# EAGLE design jkw_hdmi_v2 (EAGLE 7.6.0)
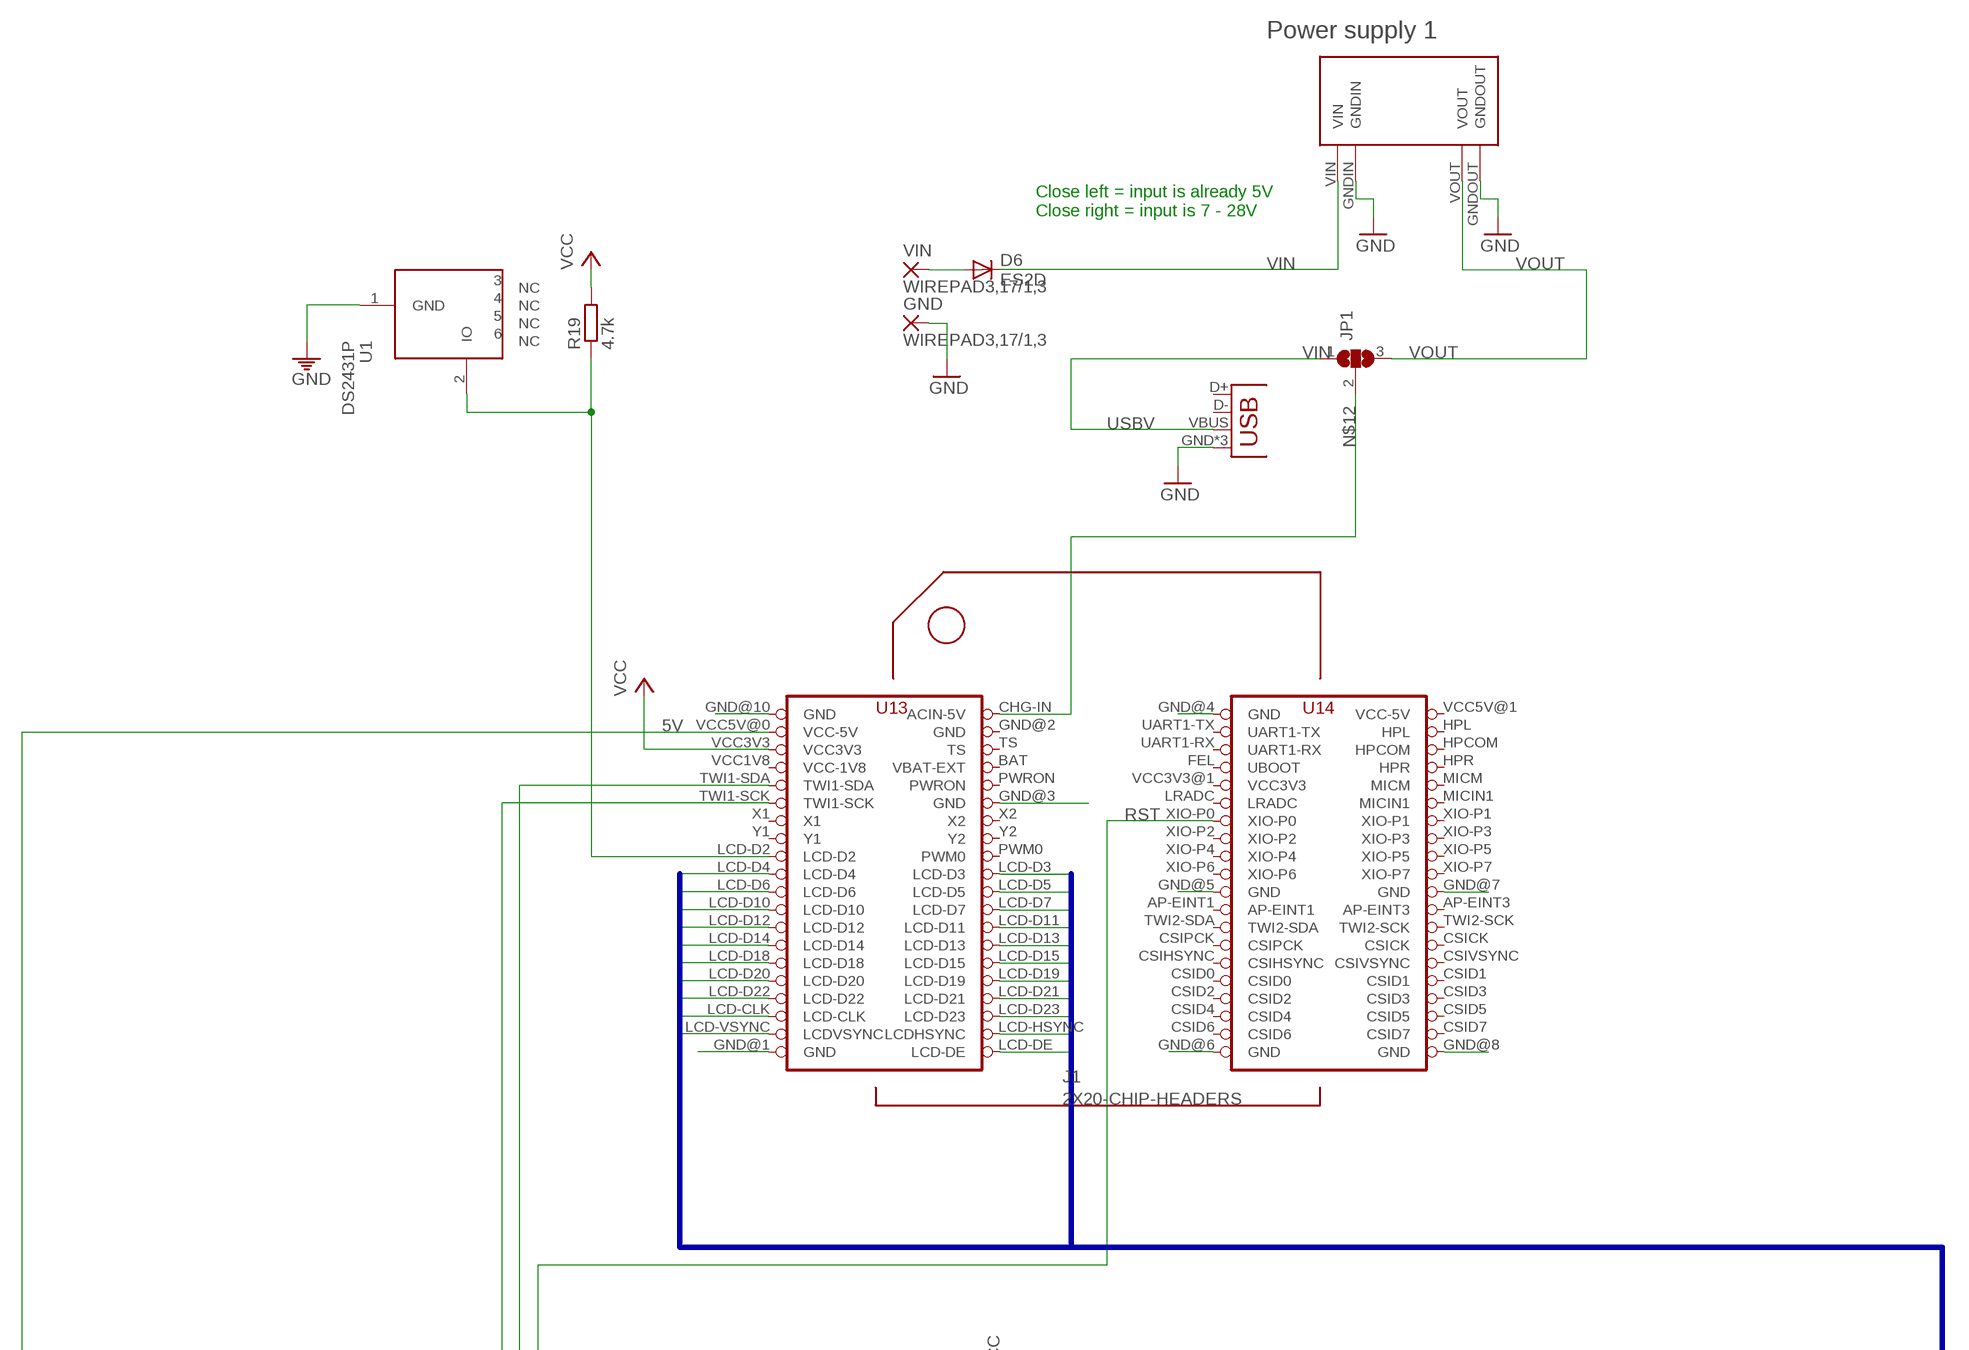
[diagram p0: schematic, sheet 1, part 1 of 2]
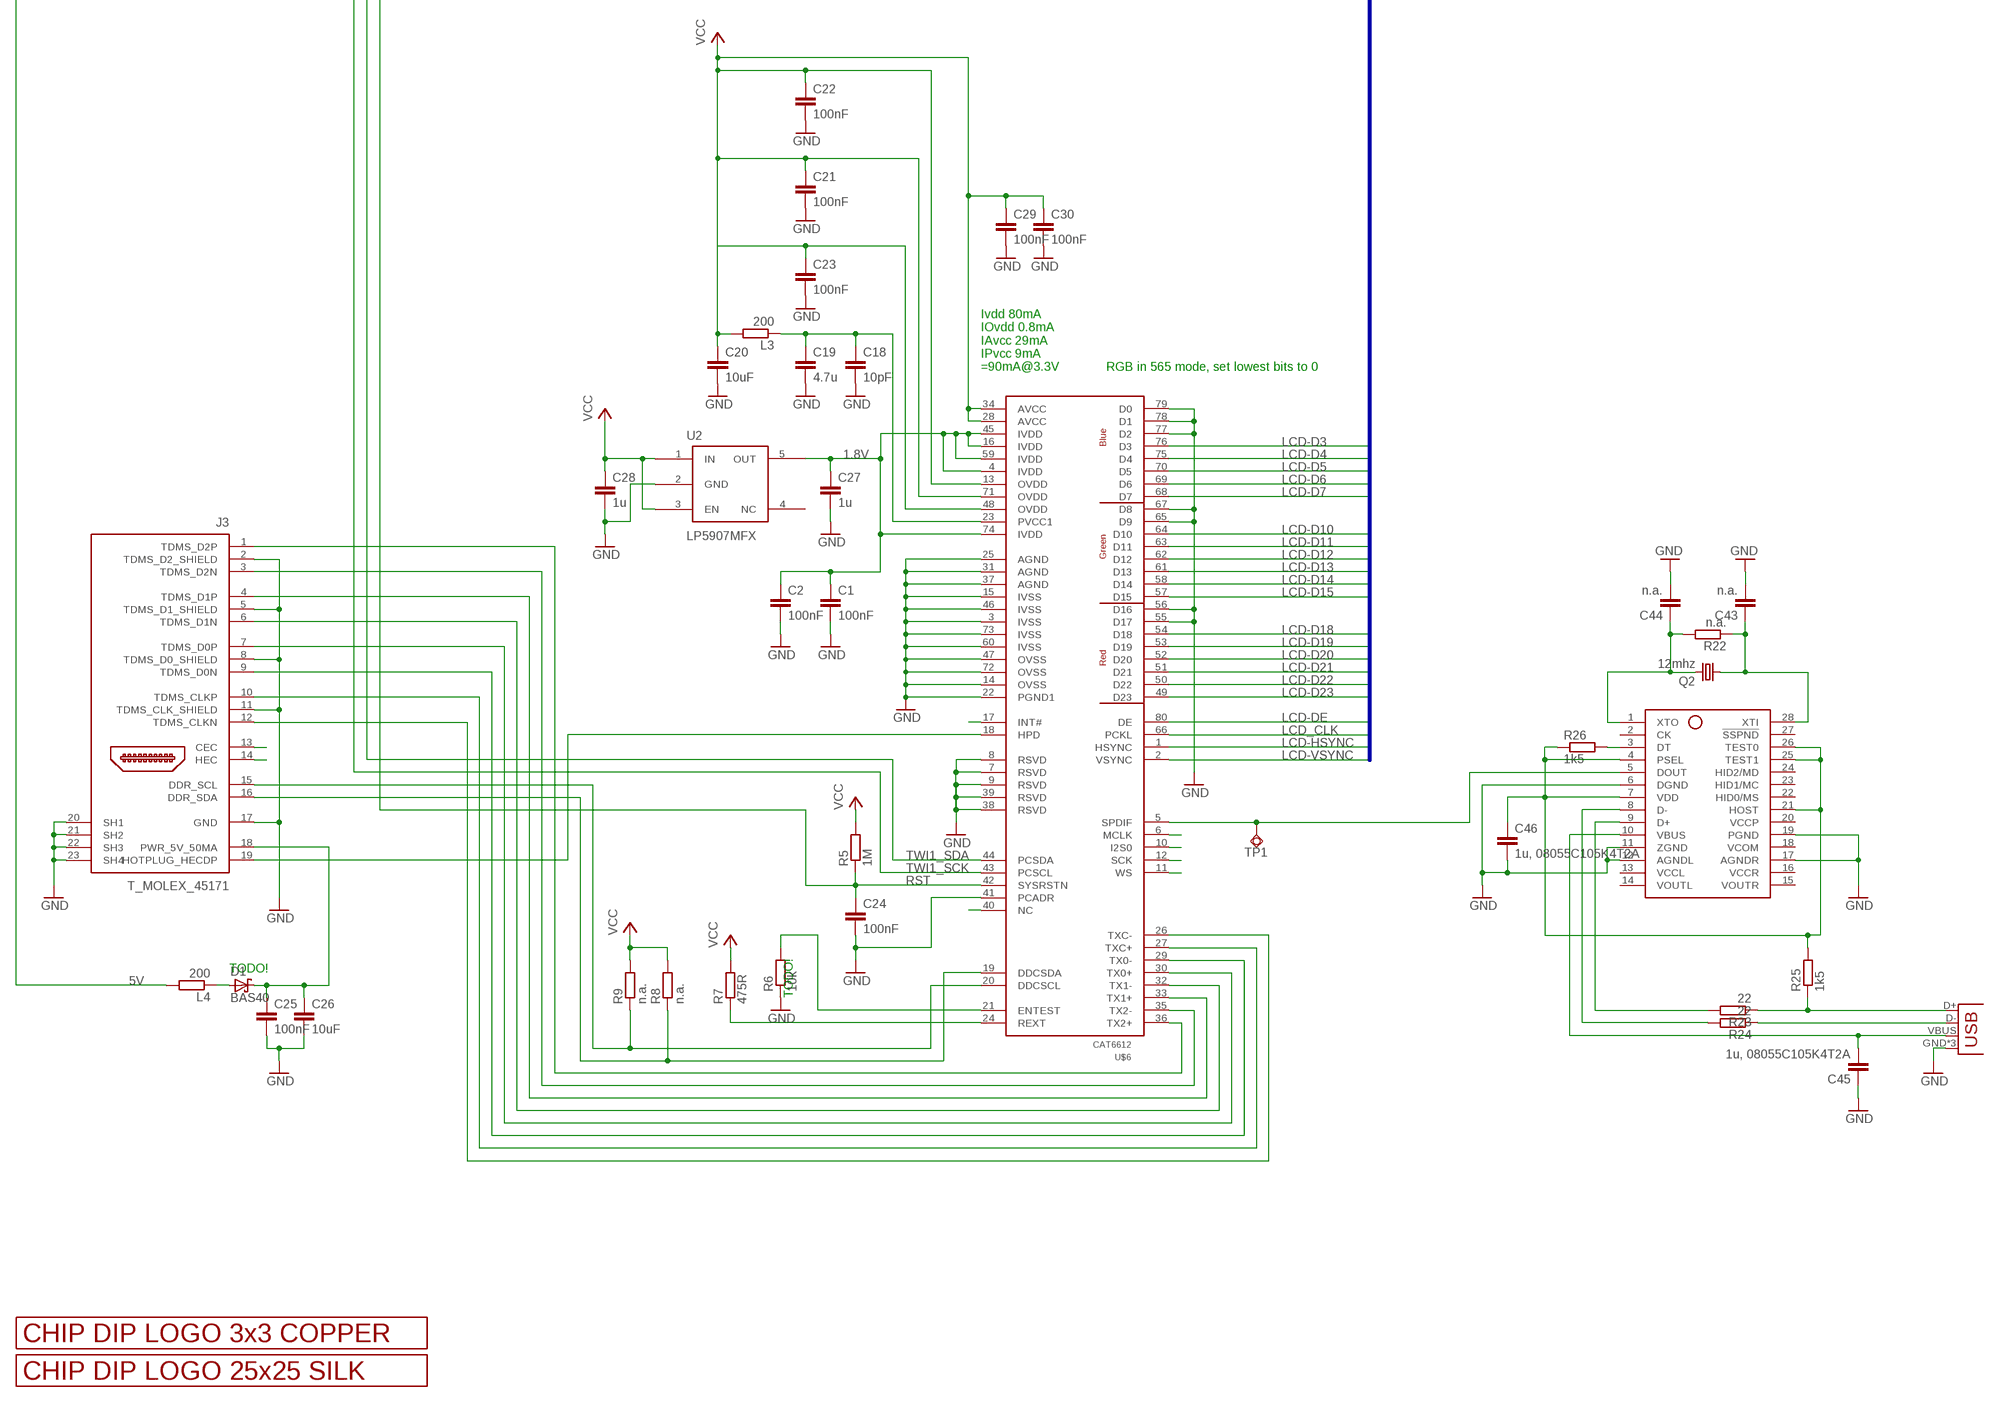
[diagram p1: schematic, sheet 1, part 2 of 2]

## Parts
AUDIO_USB  USBUSB-MICROB-SMT-DIP  [USB-MICROB-SMT-DIP]
C1  100nF  C-EUC0805  [C0805]
C2  100nF  C-EUC0805  [C0805]
C18  10pF  C-EUC0805  [C0805]
C19  4.7u  C-EUC0805  [C0805]
C20  10uF  C-EUC0805  [C0805]
C21  100nF  C-EUC0805  [C0805]
C22  100nF  C-EUC0805  [C0805]
C23  100nF  C-EUC0805  [C0805]
C24  100nF  C-EUC0805  [C0805]
C25  100nF  C-EUC0805  [C0805]
C26  10uF  C-EUC0805  [C0805]
C27  1u  C-EUC0805  [C0805]
C28  1u  C-EUC0805  [C0805]
C29  100nF  C-EUC0805  [C0805]
C30  100nF  C-EUC0805  [C0805]
C43  n.a.  C-EUC0805  [C0805]
C44  n.a.  C-EUC0805  [C0805]
C45  1u, 08055C105K4T2A  C-EUC0805  [C0805]
C46  1u, 08055C105K4T2A  C-EUC0805  [C0805]
D1  BAS40  [SOT23]
D6  ES2D  [SMB]
GND  WIREPAD3,17/1,3  [3,17/1,3]
J1  2X20-CHIP-HEADERS  [2X20CHIP_SM]
J3  T_MOLEX_45171  [T_MOLEX_45171]
JP1  SJ2W  [SJ_2]
L3  200  R-EU_R0805  [R0805]
L4  200  R-EU_R0805  [R0805]
POWER_USB  USBUSB-MICROB-SMT-DIP  [USB-MICROB-SMT-DIP]
Q2  12mhz  CRYSTALHC49UP  [HC49UP]
R5  1M  R-EU_R0805  [R0805]
R6  10k  R-EU_R0805  [R0805]
R7  475R  R-EU_R0805  [R0805]
R8  n.a.  R-EU_R0805  [R0805]
R9  n.a.  R-EU_R0805  [R0805]
R19  4.7k  R-EU_R0805  [R0805]
R22  n.a.  R-EU_M0805  [M0805]
R23  22  R-EU_M0805  [M0805]
R24  22  R-EU_M0805  [M0805]
R25  1k5  R-EU_M0805  [M0805]
R26  1k5  R-EU_M0805  [M0805]
TP1  TPSQTP12SQ  [TP12SQ]
U1  DS2431P  [TSOC6]
U2  LP5907MFX  [SOT23-5]
U$1  LOGO_25X25_SILK  [LOGO_25X25_SILK]
U$4  LOGO_3X3_COPPER  [LOGO_3X3_COPPER]
U$5  PCM2704  [SSOT28]
U$6  CAT6612  [LQFP-80]
U$9  MP1584EN_FRAMELESS  [MP1584EN_FRAMELESS]
VIN  WIREPAD3,17/1,3  [3,17/1,3]

## Nets
1.8V: C1.1 C2.1 C27.1 U2.5(OUT) U$6.4(IVDD) U$6.16(IVDD) U$6.45(IVDD) U$6.59(IVDD) U$6.74(IVDD)
5V: J1.VCC5V@0(VCC-5V) L4.2
GND: AUDIO_USB.GND AUDIO_USB.MT1(GND) AUDIO_USB.MT2(GND) C1.2 C2.2 C18.2 C19.2 C20.2 C21.2 C22.2 C23.2 C24.2 C25.2 C26.2 C27.2 C28.2 C29.2 C30.2 C43.2 C44.2 C45.1 C46.2 GND.1(P) J1.GND@1(GND) J1.GND@3(GND) J1.GND@4(GND) J1.GND@5(GND) J1.GND@6(GND) J1.GND@7(GND) J1.GND@8(GND) J1.GND@10(GND) J3.2(TDMS_D2_SHIELD) J3.5(TDMS_D1_SHIELD) J3.8(TDMS_D0_SHIELD) J3.11(TDMS_CLK_SHIELD) J3.17(GND) J3.20(SH1) J3.21(SH2) J3.22(SH3) J3.23(SH4) POWER_USB.GND POWER_USB.MT1(GND) POWER_USB.MT2(GND) R6.1 U1.1(GND) U2.2(GND) U$5.6(DGND) U$5.11(ZGND) U$5.12(AGNDL) U$5.17(AGNDR) U$5.19(PGND) U$6.3(IVSS) U$6.7(RSVD) U$6.8(RSVD) U$6.9(RSVD) U$6.14(OVSS) U$6.15(IVSS) U$6.22(PGND1) U$6.25(AGND) U$6.31(AGND) U$6.37(AGND) U$6.38(RSVD) U$6.39(RSVD) U$6.41(PCADR) U$6.46(IVSS) U$6.47(OVSS) U$6.55(D17) U$6.56(D16) U$6.60(IVSS) U$6.65(D9) U$6.67(D8) U$6.72(OVSS) U$6.73(IVSS) U$6.77(D2) U$6.78(D1) U$6.79(D0) U$9.GNDIN U$9.GNDOUT
LCD-D3: J1.LCD-D3 U$6.76(D3)
LCD-D4: J1.LCD-D4 U$6.75(D4)
LCD-D5: J1.LCD-D5 U$6.70(D5)
LCD-D6: J1.LCD-D6 U$6.69(D6)
LCD-D7: J1.LCD-D7 U$6.68(D7)
LCD-D10: J1.LCD-D10 U$6.64(D10)
LCD-D11: J1.LCD-D11 U$6.63(D11)
LCD-D12: J1.LCD-D12 U$6.62(D12)
LCD-D13: J1.LCD-D13 U$6.61(D13)
LCD-D14: J1.LCD-D14 U$6.58(D14)
LCD-D15: J1.LCD-D15 U$6.57(D15)
LCD-D18: J1.LCD-D18 U$6.54(D18)
LCD-D19: J1.LCD-D19 U$6.53(D19)
LCD-D20: J1.LCD-D20 U$6.52(D20)
LCD-D21: J1.LCD-D21 U$6.51(D21)
LCD-D22: J1.LCD-D22 U$6.50(D22)
LCD-D23: J1.LCD-D23 U$6.49(D23)
LCD-DE: J1.LCD-DE U$6.80(DE)
LCD-HSYNC: J1.LCD-HSYNC(LCDHSYNC) U$6.1(HSYNC)
LCD-VSYNC: J1.LCD-VSYNC(LCDVSYNC) U$6.2(VSYNC)
LCD_CLK: J1.LCD-CLK U$6.66(PCKL)
N$5: J1.LCD-D2 R19.1 U1.2(IO)
N$11: J3.12(TDMS_CLKN) U$6.26(TXC-)
N$12: J1.CHG-IN(ACIN-5V) JP1.2
N$14: J3.10(TDMS_CLKP) U$6.27(TXC+)
N$15: J3.1(TDMS_D2P) U$6.36(TX2+)
N$16: J3.3(TDMS_D2N) U$6.35(TX2-)
N$17: J3.4(TDMS_D1P) U$6.33(TX1+)
N$18: J3.6(TDMS_D1N) U$6.32(TX1-)
N$19: J3.7(TDMS_D0P) U$6.30(TX0+)
N$20: J3.9(TDMS_D0N) U$6.29(TX0-)
N$21: U$6.11(WS)
N$22: J3.19(HOTPLUG_HECDP) U$6.18(HPD)
N$23: U$6.40(NC)
N$24: C18.1 C19.1 L3.1 U$6.23(PVCC1)
N$25: J3.16(DDR_SDA) R8.1 U$6.19(DDCSDA)
N$26: U$6.12(SCK)
N$27: J3.15(DDR_SCL) R9.1 U$6.20(DDCSCL)
N$28: R6.2 U$6.21(ENTEST)
N$29: R7.1 U$6.24(REXT)
N$30: U$6.10(I2S0)
N$31: U$6.6(MCLK)
N$32: TP1.TP U$5.5(DOUT) U$6.5(SPDIF)
N$33: D1.1(A) L4.1
N$34: U$6.17(INT#)
N$35: C25.1 C26.1 D1.3(C) J3.18(PWR_5V_50MA)
N$36: J3.14(HEC)
N$37: J3.13(CEC)
N$57: C44.1 Q2.2 R22.2 U$5.1(XTO)
N$58: C43.1 Q2.1 R22.1 U$5.28(XTI)
N$61: R23.2 U$5.9(D+)
N$62: AUDIO_USB.D+ R23.1 R25.1
N$63: R24.2 U$5.8(D-)
N$64: AUDIO_USB.D- R24.1
N$65: D6.A VIN.1(P)
N$66: AUDIO_USB.VBUS C45.2 U$5.10(VBUS)
N$69: R26.2 U$5.3(DT)
RST: C24.1 J1.XIO-P0 R5.1 U$6.42(SYSRSTN)
TWI1_SCK: J1.TWI1-SCK U$6.43(PCSCL)
TWI1_SDA: J1.TWI1-SDA U$6.44(PCSDA)
USBV: JP1.1 POWER_USB.VBUS
VCC: C20.1 C21.1 C22.1 C23.1 C28.1 C29.1 C30.1 J1.VCC3V3 L3.2 R5.2 R7.2 R8.2 R9.2 R19.2 U2.1(IN) U2.3(EN) U$6.13(OVDD) U$6.28(AVCC) U$6.34(AVCC) U$6.48(OVDD) U$6.71(OVDD)
VCC2: C46.1 R25.2 R26.1 U$5.4(PSEL) U$5.7(VDD) U$5.21(HOST) U$5.25(TEST1) U$5.26(TEST0)
VIN: D6.C U$9.VIN
VOUT: JP1.3 U$9.VOUT
Unconnected: J1.AP-EINT1 J1.AP-EINT3 J1.BAT(VBAT-EXT) J1.CSICK J1.CSID0 J1.CSID1 J1.CSID2 J1.CSID3 J1.CSID4 J1.CSID5 J1.CSID6 J1.CSID7 J1.CSIHSYNC J1.CSIPCK J1.CSIVSYNC J1.FEL(UBOOT) J1.HPCOM J1.HPL J1.HPR J1.LRADC J1.MICIN1 J1.MICM J1.PWM0 J1.PWRON J1.TS J1.TWI2-SCK J1.TWI2-SDA J1.UART1-RX J1.UART1-TX J1.X1 J1.X2 J1.XIO-P1 J1.XIO-P2 J1.XIO-P3 J1.XIO-P4 J1.XIO-P5 J1.XIO-P6 J1.XIO-P7 J1.Y1 J1.Y2 POWER_USB.D+ POWER_USB.D- U1.3(NC) U1.4(NC) U1.5(NC) U1.6(NC) U2.4(NC) U$5.2(CK) U$5.14(VOUTL) U$5.15(VOUTR) U$5.22(HID0/MS) U$5.23(HID1/MC) U$5.24(HID2/MD) U$5.27(!SSPND)

## Buses
B$1

## Notes on the sheet
- Power supply 1
- Close left = input is already 5V
  Close right = input is 7 - 28V
- Ivdd 80mA
  IOvdd 0.8mA
  IAvcc 29mA
  IPvcc 9mA
  =90mA@3.3V
- RGB in 565 mode, set lowest bits to 0
- TODO!
- TODO!

## Power pins joined to a net without a drawn wire
GND: J1.GND@2(GND)
VCC3V3: J1.VCC3V3@1(VCC3V3)
VCC-1V8: J1.VCC1V8(VCC-1V8)
VCC-5V: J1.VCC5V@1(VCC-5V)
VCCL: U$5.13(VCCL)
VCCP: U$5.20(VCCP)
VCCR: U$5.16(VCCR)
VCOM: U$5.18(VCOM)

## Library data of the parts
AUDIO_USB POWER_USB = Spark:USB
C1 C2 C18-C30 C43-C46 = rcl:C-EU: CAPACITOR, European symbol
D1 = diode:BAS40: Silicon Schottky Diodes General-purpose diode for high-speed switching
D6 = diode:ES2D: DIODE super fast rectifier, 2 A
GND VIN = wirepad:WIREPAD: Wire PAD connect wire on PCB
J1 = VGA-DIP:2X20-CHIP-HEADERS: Through hole layout with chip reference
J3 = CHIP_HDMI:T_MOLEX_45171
JP1 = jumper:SJ2W: SMD solder JUMPER
L3 L4 R5-R9 R19 R22-R26 = rcl:R-EU_: RESISTOR, European symbol
Q2 = crystal:CRYSTAL: CRYSTAL; OC_FARNELL: unknown; OC_NEWARK: unknown
TP1 = testpad:TPSQ: Test pad
U1 = VGA-DIP:DS2431: 1024-Bit EEPROM This chip provides a 4x256 Bit EEPROM, which can be programmed@5V. Write protection and OTP emulation are available, too. Author: Jan Kandziora <jjj@gmx.de>; DESCRIPTION: IC, 1024-Bit, 1-Wire EEPROM, TSOC6; FOOTPRINT: TSOC6; LINK: http://www.digikey.com/product-detail/en/DS2431P%2BT%26R/DS2431P%2BT%26RCT-ND/3647900; MFG: DIGIKEY; MFG_PN: DS2431P+T&RCT-ND; PART_TYPE: IC; PRICE: 0.98; VENDOR: MAXIM; VENDOR_PART_NUMBER: DS2431P+T&R
U2 = JKW_CHIP:LP5907MFX
U$1 = JKW_CHIP:LOGO_25X25_SILK
U$4 = JKW_CHIP:LOGO_3X3_COPPER
U$5 = JKW_CHIP:PCM2704
U$6 = JKW_CHIP:CAT6612
U$9 = JKW_CHIP:MP1584EN_FRAMELESS

## Board
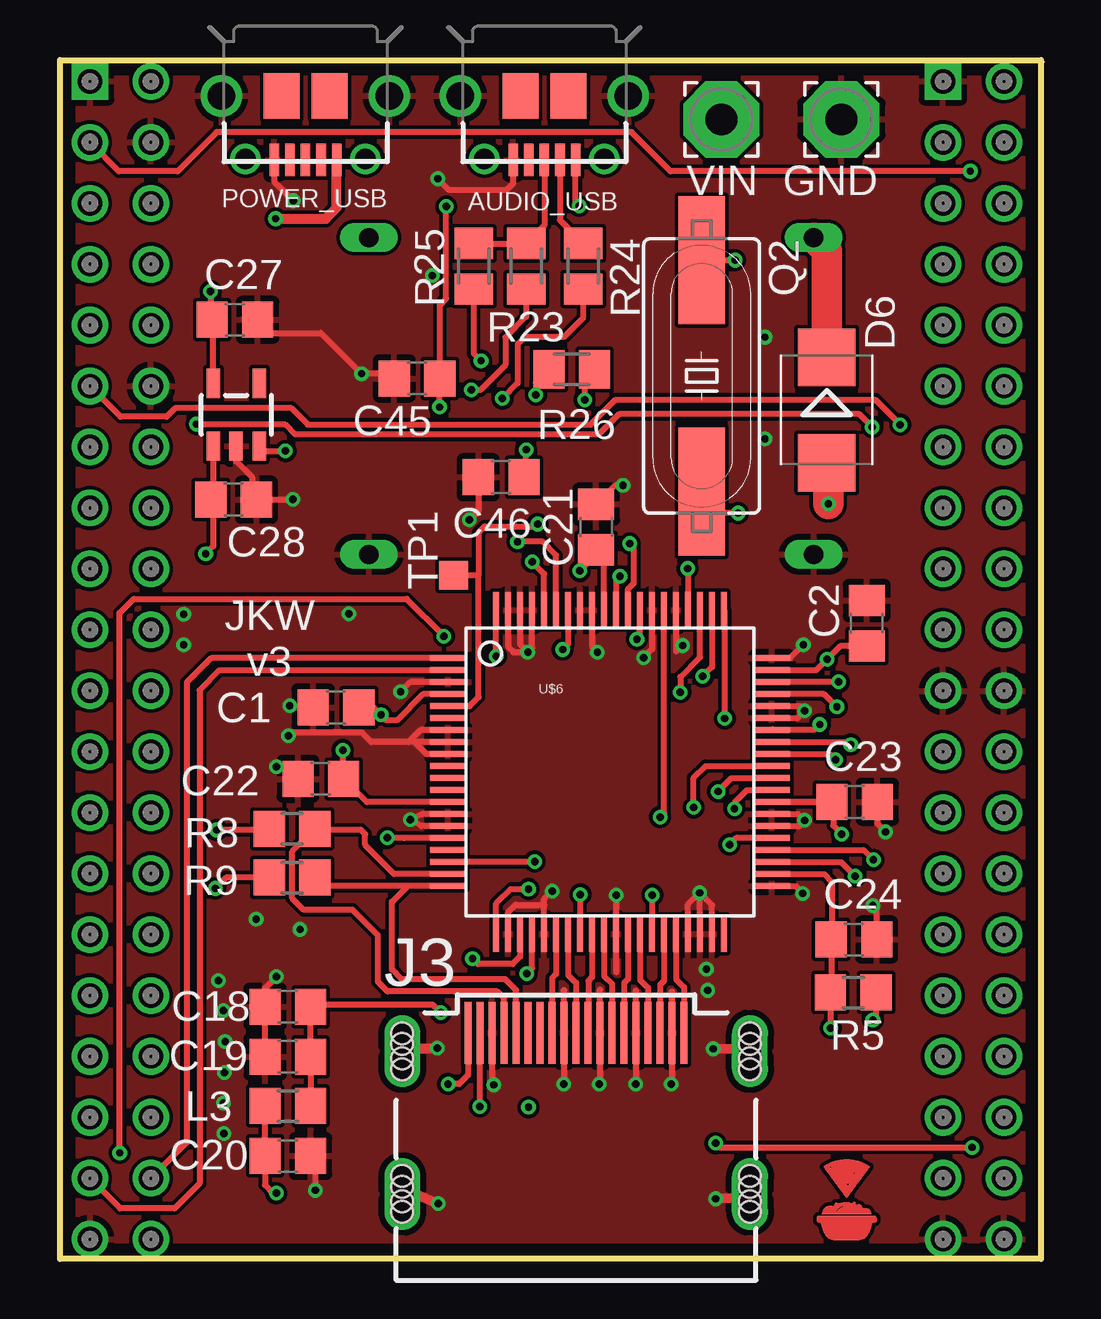
[diagram p2: board, top side]
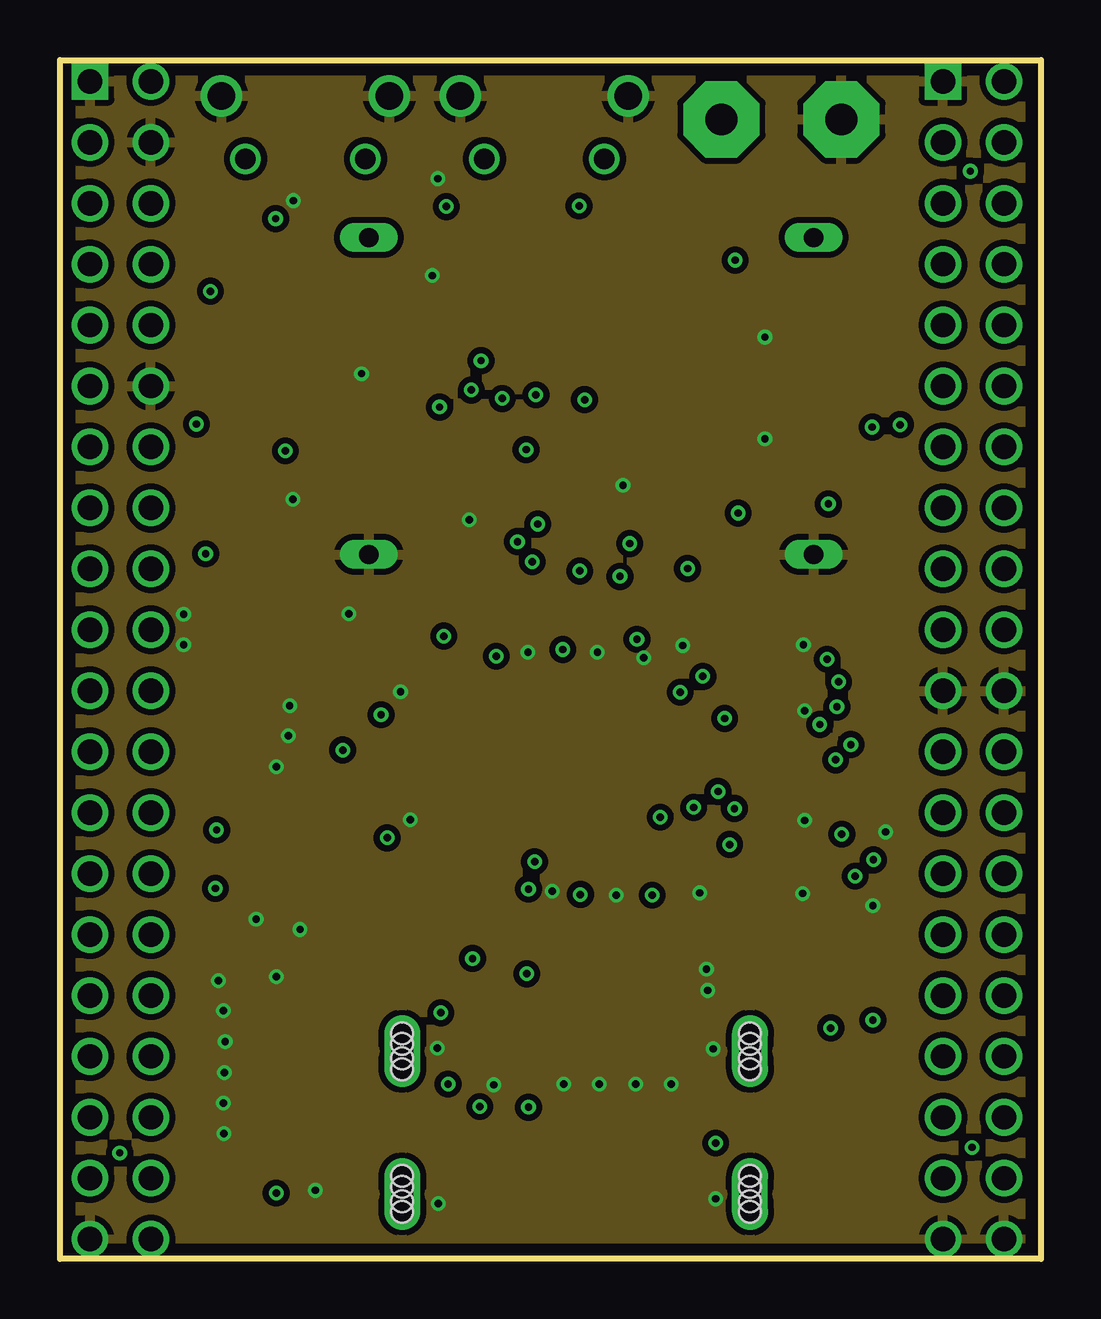
[diagram p3: board, inner layer Route2]
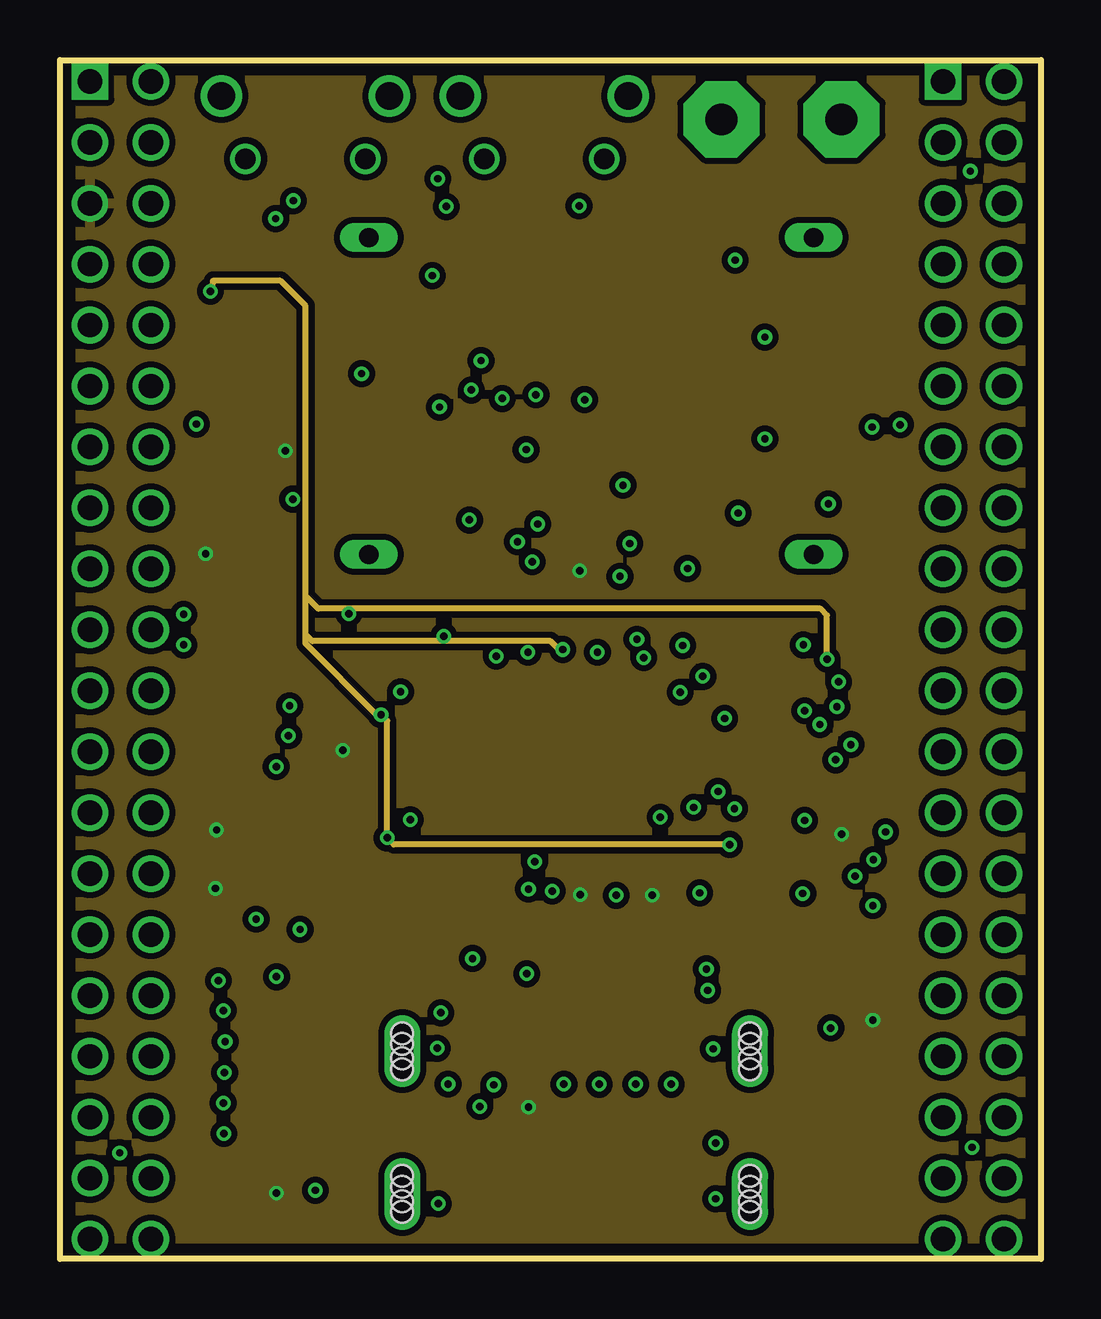
[diagram p4: board, inner layer Route15]
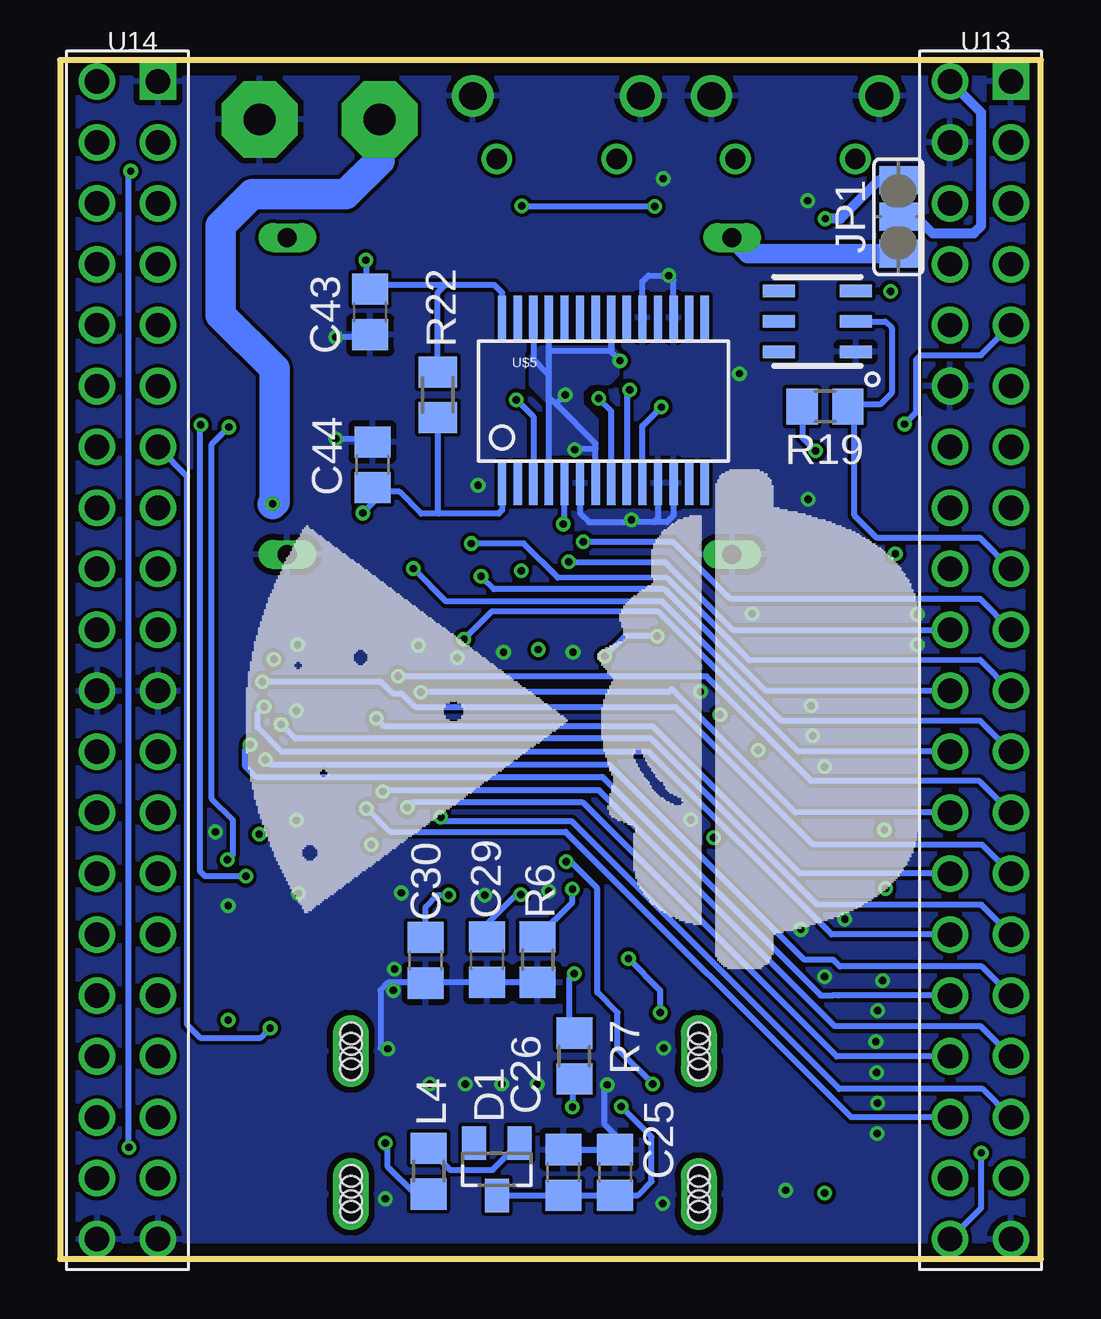
[diagram p5: board, bottom side, seen from below]

Size 40.89 x 49.97 mm. Coordinates in mm from the lower left corner, seen from the top.
Outline: 0,49.97 40.89,49.97 40.89,0 0,0 0,49.97
Copper layers (1*2*15*16): Top 0.035mm / dielectric 0.2mm / Route2 0.035mm / dielectric 1.2mm / Route15 0.035mm / dielectric 0.2mm / Bottom 0.035mm
Design rules "Elecrow_4-layer_PCB_eagle_rule": minimum track width 6mil, minimum drill 12mil, track to track 6mil, track to pad 6mil, pad to pad 6mil, via to via 8mil, smd to smd 0mil, copper to edge 20mil, drill to drill 10mil, minimum pad ring 6mil, minimum via ring 6mil, stop-mask expansion 0mil, vias tented up to drill 100mil, thermal gap 10mil

### Footprints (pad centres in the part's own frame; a part is rotated, then mirrored left to right if it is on the bottom)
USB-MICROB-SMT-DIP = smd 0.4 x 1.35: D+ 0,2.675; D- -0.65,2.675; GND 1.3,2.675; ID 0.65,2.675; VBUS -1.3,2.675 | drill 1.15 pad 1.7: MT1 -3.5,0; MT2 3.5,0 | drill 0.85 pad 1.25: MT3 -2.5,2.625; MT4 2.5,2.625 | smd 1.5 x 1.9: P$1 -1,0; P$2 1,0.01
C0805 = smd 1.3 x 1.5: 1 -0.95,0; 2 0.95,0
SOT23 = smd 1 x 1.4: 1 -0.95,-1.1; 2 0.95,-1.1; 3 0,1.1
SMB = smd 2.4 x 2.4: A 2.2,0; C -2.2,0
3,17/1,3 = drill 1.321 pad 3.175 octagon: 1 0,0
2X20CHIP_SM = drill 1.016: AP-EINT1 36.81,21.65; AP-EINT3 39.35,21.65; BAT 3.79,41.97; CHG-IN 3.79,49.59; CSICK 39.35,16.57; CSID0 36.81,11.49; CSID1 39.35,11.49; CSID2 36.81,8.95; CSID3 39.35,8.95; CSID4 36.81,6.41; CSID5 39.35,6.41; CSID6 36.81,3.87; CSID7 39.35,3.87; CSIHSYNC 36.81,14.03; CSIPCK 36.81,16.57; CSIVSYNC 39.35,14.03; FEL 36.81,41.97; GND@1 3.79,36.89; GND@2 1.25,1.33; GND@4 39.35,24.19; GND@5 39.35,1.33; GND@6 36.81,1.33; GND@7 36.81,24.19; GND@10 3.79,47.05; HPCOM 39.35,44.51; HPL 39.35,47.05; HPR 39.35,41.97; LCD-CLK 1.25,6.41; LCD-D2 1.25,29.27; LCD-D3 3.79,26.73; LCD-D4 1.25,26.73; LCD-D5 3.79,24.19; LCD-D6 1.25,24.19; LCD-D7 3.79,21.65; LCD-D10 1.25,21.65; LCD-D11 3.79,19.11; LCD-D12 1.25,19.11; LCD-D13 3.79,16.57; LCD-D14 1.25,16.57; LCD-D15 3.79,14.03; LCD-D18 1.25,14.03; LCD-D19 3.79,11.49; LCD-D20 1.25,11.49; LCD-D21 3.79,8.95; LCD-D22 1.25,8.95; LCD-D23 3.79,6.41; LCD-DE 3.79,1.33; LCD-HSYNC 3.79,3.87; LCD-VSYNC 1.25,3.87; LRADC 36.81,36.89; MICIN1 39.35,36.89; MICM 39.35,39.43; PWM0 3.79,29.27; PWRON 3.79,39.43; TS 3.79,44.51; TWI1-SCK 1.25,36.89; TWI1-SDA 1.25,39.43; TWI2-SCK 39.35,19.11; TWI2-SDA 36.81,19.11; UART1-RX 36.81,44.51; UART1-TX 36.81,47.05; VCC1V8 1.25,41.97; VCC3V3 1.25,44.51; VCC3V3@1 36.81,39.43; VCC5V@0 1.25,47.05; VCC5V@1 39.35,49.59; X1 1.25,34.35; X2 3.79,34.35; XIO-P0 36.81,34.35; XIO-P1 39.35,34.35; XIO-P2 36.81,31.81; XIO-P3 39.35,31.81; XIO-P4 36.81,29.27; XIO-P5 39.35,29.27; XIO-P6 36.81,26.73; XIO-P7 39.35,26.73; Y1 1.25,31.81; Y2 3.79,31.81 | drill 1.016 square: GND@3 1.25,49.59; GND@8 36.81,49.59
T_MOLEX_45171 = smd 0.3 x 2.6: 1 4.5,10.31; 2 4,10.31; 3 3.5,10.31; 4 3,10.31; 5 2.5,10.31; 6 2,10.31; 7 1.5,10.31; 8 1,10.31; 9 0.5,10.31; 10 0,10.31; 11 -0.5,10.31; 12 -1,10.31; 13 -1.5,10.31; 14 -2,10.31; 15 -2.5,10.31; 16 -3,10.31; 17 -3.5,10.31; 18 -4,10.31; 19 -4.5,10.31 | drill 0.9 pad 1.499 long: 20 -7.25,3.59; 21 7.25,3.59; 22 7.25,9.55; 23 -7.25,9.55 | hole 0.9: -7.25,10.3; -7.25,8.8; -7.25,9.85; -7.25,9.25; -7.25,4.35; -7.25,2.85; -7.25,3.9; -7.25,3.3; 7.25,10.3; 7.25,8.8; 7.25,9.85; 7.25,9.25; 7.25,4.35; 7.25,3.9; 7.25,2.85; 7.25,3.3
SJ_2 = smd 1.168 x 1.6: 1 -1.524,0; 2 0,0; 3 1.524,0
R0805 = smd 1.3 x 1.5: 1 -0.95,0; 2 0.95,0
HC49UP = smd 5.334 x 1.93: 1 -4.826,0; 2 4.826,0
M0805 = smd 1.3 x 1.6: 1 -0.95,0; 2 0.95,0
TP12SQ = smd 1.2 x 1.2: TP 0,0
TSOC6 = smd 0.53 x 1.33: 1 -1.27,-1.6; 2 0,-1.6; 3 1.27,-1.6; 4 1.27,1.6; 5 0,1.6; 6 -1.27,1.6
SOT23-5 = smd 0.559 x 1.219: 1 -0.95,-1.3; 2 0,-1.3; 3 0.965,-1.3; 4 0.965,1.321; 5 -0.95,1.321
SSOT28 = smd 0.348 x 1.8: 1 -4.303,-3.964; 2 -3.653,-3.964; 3 -3.003,-3.964; 4 -2.353,-3.964; 5 -1.703,-3.964; 6 -1.053,-3.964; 7 -0.403,-3.964; 8 0.247,-3.964; 9 0.897,-3.964; 10 1.547,-3.964; 11 2.197,-3.964; 12 2.847,-3.964; 13 3.497,-3.964; 14 4.147,-3.964; 15 4.147,2.948; 16 3.497,2.948; 17 2.847,2.948; 18 2.197,2.948; 19 1.547,2.948; 20 0.897,2.948; 21 0.247,2.948; 22 -0.403,2.948; 23 -1.053,2.948; 24 -1.703,2.948; 25 -2.353,2.948; 26 -3.003,2.948; 27 -3.653,2.948; 28 -4.303,2.948
LQFP-80 = smd 1.5 x 0.25: 1 -6.75,4.75; 2 -6.75,4.25; 3 -6.75,3.75; 4 -6.75,3.25; 5 -6.75,2.75; 6 -6.75,2.25; 7 -6.75,1.75; 8 -6.75,1.25; 9 -6.75,0.75; 10 -6.75,0.25; 11 -6.75,-0.25; 12 -6.75,-0.75; 13 -6.75,-1.25; 14 -6.75,-1.75; 15 -6.75,-2.25; 16 -6.75,-2.75; 17 -6.75,-3.25; 18 -6.75,-3.75; 19 -6.75,-4.25; 20 -6.75,-4.75; 41 6.75,-4.75; 42 6.75,-4.25; 43 6.75,-3.75; 44 6.75,-3.25; 45 6.75,-2.75; 46 6.75,-2.25; 47 6.75,-1.75; 48 6.75,-1.25; 49 6.75,-0.75; 50 6.75,-0.25; 51 6.75,0.25; 52 6.75,0.75; 53 6.75,1.25; 54 6.75,1.75; 55 6.75,2.25; 56 6.75,2.75; 57 6.75,3.25; 58 6.75,3.75; 59 6.75,4.25; 60 6.75,4.75 | smd 0.25 x 1.5: 21 -4.75,-6.75; 22 -4.25,-6.75; 23 -3.75,-6.75; 24 -3.25,-6.75; 25 -2.75,-6.75; 26 -2.25,-6.75; 27 -1.75,-6.75; 28 -1.25,-6.75; 29 -0.75,-6.75; 30 -0.25,-6.75; 31 0.25,-6.75; 32 0.75,-6.75; 33 1.25,-6.75; 34 1.75,-6.75; 35 2.25,-6.75; 36 2.75,-6.75; 37 3.25,-6.75; 38 3.75,-6.75; 39 4.25,-6.75; 40 4.75,-6.75; 61 4.75,6.75; 62 4.25,6.75; 63 3.75,6.75; 64 3.25,6.75; 65 2.75,6.75; 66 2.25,6.75; 67 1.75,6.75; 68 1.25,6.75; 69 0.75,6.75; 70 0.25,6.75; 71 -0.25,6.75; 72 -0.75,6.75; 73 -1.25,6.75; 74 -1.75,6.75; 75 -2.25,6.75; 76 -2.75,6.75; 77 -3.25,6.75; 78 -3.75,6.75; 79 -4.25,6.75; 80 -4.75,6.75
MP1584EN_FRAMELESS = drill 0.8 long: GNDIN 1.778,14.986; GNDOUT 20.32,14.986; VIN 1.778,1.778; VOUT 20.32,1.778

### Placement (x,y rotation side)
AUDIO_USB  20.19,48.48 180 top
C1  11.51,22.99 180 top
C2  33.63,26.49 90 top
C18  9.5,10.52 180 top
C19  9.5,8.43 180 top
C20  9.5,4.29 0 top
C21  22.35,30.51 90 top
C22  10.87,20.02 180 top
C23  33.12,19.05 0 top
C24  33.1,13.31 0 top
C25  17.75,3.61 90 bottom
C26  19.91,3.61 90 bottom
C27  7.29,39.14 0 top
C28  7.24,31.65 0 top
C29  23.09,12.47 270 bottom
C30  25.65,12.45 270 bottom
C43  27.97,39.47 270 bottom
C44  27.86,33.1 90 bottom
C45  14.88,36.7 0 top
C46  18.39,32.59 180 top
D1  22.68,3.73 180 bottom
D6  31.97,35.38 270 top
GND  32.57,47.5 180 top
J1  0,-0.51 0 top
J3  21.51,-0.89 0 top
JP1  5.94,43.43 270 bottom
L3  9.5,6.38 180 top
L4  25.53,3.66 270 bottom
POWER_USB  10.24,48.48 180 top
Q2  26.75,36.8 270 top
R5  33.07,11.1 0 top
R6  20.98,12.47 90 bottom
R7  19.46,8.46 270 bottom
R8  9.68,17.93 180 top
R9  9.68,15.9 180 top
R19  9,35.53 180 bottom
R22  25.15,36.02 270 bottom
R23  19.43,41.38 270 top
R24  21.82,41.38 270 top
R25  17.25,41.38 270 top
R26  21.34,37.08 0 top
TP1  16.41,28.5 90 top
U1  9.32,39.08 90 bottom
U2  7.34,35.18 0 top
U$1  5.03,12.04 90 bottom
U$4  32.79,2.46 0 top
U$5  18.16,36.3 0 bottom
U$6  22.94,20.29 0 top
U$9  33.2,44.35 180 top
VIN  27.57,47.5 180 top

### Tracks (layer width: path | path; a pad name or v marks a point on that pad's centre or on a via)
1.8V  (via drill 0.3)
  Top 0.254: U2.5 6.39,39.09 C27.1 6.27,39.21 v6.27,40.34 | U$6.16 14.36,17.55 14.35,17.55 v13.64,17.55 | U$6.4 15.14,23.55 14.05,22.45 13.61,22.45 v13.39,22.68 13.08,22.99 C1.1 | U$6.74 21.19,25.63 v20.95,25.4 | U$6.59 31.53,24.55 v31.98,24.99 32.53,25.54 C2.1 | U$6.45 28.19,17.55 v27.91,17.27
  Route15 0.254: 10.24,26.04 10.24,25.65 13.21,22.68 v13.39,22.68 13.64,22.43 v13.64,17.55 13.92,17.27 v27.91,17.27 | 10.24,26.04 10.24,27.64 | 10.24,27.64 10.24,39.73 9.2,40.77 6.38,40.77 v6.27,40.34 | v20.95,25.4 20.8,25.4 20.45,25.76 10.52,25.76 10.24,26.04 | v31.98,24.99 31.98,26.82 31.7,27.1 10.77,27.1 10.24,27.64
5V  (via drill 0.3)
  Top 0.254: v27.33,4.83 27.51,4.65 v38.02,4.65 | v37.95,45.34 25.45,45.34 23.82,46.97 6.53,46.97 4.9,45.34 2.45,45.34 J1.VCC5V@0
  Bottom 0.254: L4.2 26.1,2.71 27.23,3.83 27.23,4.72 v27.33,4.83 | v38.02,4.65 38.02,45.26 v37.95,45.34
GND  (via drill 0.3)
  Top 0.254: 21.01,11.2 21.01,11.19 J3.11 21.01,7.3 v21.01,7.28 | 22.5,11.23 22.51,11.22 J3.8 22.51,7.32 v22.48,7.28 | 24,11.18 24.01,11.16 J3.5 24.01,7.29 v24,7.28 | J3.2 25.51,11.14 25.5,11.15 25.5,7.31 v25.48,7.28 | U$6.31 23.19,11.97 23.19,11.96 v23.19,15.16 | U$6.37 26.19,14.77 v26.67,15.26 | U$6.38 26.69,15.24 v26.67,15.26 | U$6.39 27.19,14.74 v26.67,15.26 | C24.2 34.05,14.56 v33.88,14.72 | U$6.22 18.69,14.44 19,14.76 20.16,14.76 arc-90 20.19,14.73 | U$6.25 20.19,14.73 | C27.2 8.24,38.59 10.88,38.59 v12.57,36.9 13.74,36.9 C45.1 | 18.69,25.71 U$6.79 18.69,25.51 18.91,25.29 v19.51,25.29 | U$6.77 19.69,25.47 v19.51,25.29 | U$6.65 25.69,25.34 v25.96,25.57 | U$6.67 24.69,25.41 v24.33,25.06 | C22.2 9.42,20.52 v9.02,20.52 | U$6.3 14.6,24.05 v14.2,23.64 | U$6.15 15.07,18.05 v14.61,18.31 15.1,18.55 U$6.14 | J3.17 18.01,7.33 v18.09,7.26 | U$6.60 30.44,25.05 v30.99,25.59 | U$6.56 30.85,23.05 v31.04,22.85 30.73,22.55 U$6.55 | U$6.41 30.65,15.54 v30.96,15.23 | U$6.47 30.77,18.55 v31.04,18.28 30.8,18.05 U$6.46 | C23.2 34.07,18.14 v34.42,17.8 | C21.2 23.15,32.25 v23.47,32.25 | C46.2 17.44,31.17 v17.07,30.8 | C19.2 C18.2 8.55,11.29 v9.03,11.76 | 20.19,14.73 20.19,15 v20.52,15.33 | v9.7,31.67 9.69,31.65 C28.2 8,31.84 8,32.59 7.34,33.25 U2.2 | POWER_USB.GND 8.94,44.9 v9.73,44.11 | AUDIO_USB.GND 18.89,44.83 18.62,44.55 16.22,44.55 v15.75,45.03 | C20.2 10.64,4.1 v10.64,2.86 | U$6.78 19.19,25.61 v19.51,25.29 | U$6.72 22.19,25.51 v22.4,25.29 | U$6.8 14.78,21.55 | 14.78,21.55 14.53,21.55 | 14.53,21.55 12.97,21.55 12.57,21.95 9.66,21.95 v9.53,21.81 | U$6.7 15.03,22.05 14.53,21.55 | U$6.9 15.28,21.05 14.78,21.55
  Top 0.406: J3.23 14.38,8.78 v15.72,8.78 | J3.20 14.45,2.89 v15.77,2.3 | J3.21 28.62,2.56 v27.33,2.51 | J3.22 28.7,8.73 v27.23,8.76
  Bottom 0.254: v18.09,7.26 18.19,7.16 18.19,5.61 17.75,5.18 C25.2 C26.2 | U$5.17 15.31,40.78 v15.52,40.99 16.36,40.99 16.61,40.74 U$5.19 | U$5.6 19.21,31.08 18.85,30.71 17.16,30.71 | 17.16,30.71 v17.07,30.8 | U$5.12 15.31,30.99 15.6,30.71 16.13,30.71 | 16.13,30.71 17.16,30.71 | U$5.11 15.96,30.87 16.13,30.71 | C43.2 28.07,38.42 v29.39,38.42 | C44.2 28,34.18 v29.39,34.18 | R6.1 27.21,11.52 27.53,11.2 27.53,8.78 v27.23,8.76
  other vias: 5.16,26.87 12.04,26.89 5.16,25.6 9.58,23.06 8.18,14.17 10.01,13.73 6.6,11.6 6.81,10.36 6.88,9.06 6.86,7.76 6.81,6.49 6.83,5.22 26.95,12.08 27,11.19
  pour Top: 0.13,0 40.89,0 40.89,50 0.13,50
  pour Bottom (rank 2): 0.13,0 40.89,0 40.89,50 0.13,50
  pour Route2 (isolate 0.254): 0.4,49.6 40.6,49.6 40.6,0.4 0.4,0.4
LCD-D3  (via drill 0.3)
  Top 0.254: U$6.76 20.19,28.56 v19.68,29.06
  Bottom 0.254: v19.68,29.06 15.67,29.06 12.84,26.22 J1.LCD-D3
LCD-D4  (via drill 0.3)
  Top 0.254: U$6.75 20.69,29.33 20.12,29.9 v19.07,29.9
  Bottom 0.254: v19.07,29.9 15.34,29.9 12.95,27.51 2.54,27.51 J1.LCD-D4
LCD-D5  (via drill 0.3)
  Top 0.254: v23.34,28.45 23.19,28.29 U$6.70
  Bottom 0.254: J1.LCD-D5 11.46,23.68 15.7,27.91 22.81,27.91 v23.34,28.45
LCD-D6  (via drill 0.3)
  Top 0.254: 23.69,29.76 v23.75,29.82 23.93,29.64 23.93,28.17 23.69,27.93 U$6.69
  Bottom 0.254: J1.LCD-D6 2.54,24.97 12.14,24.94 15.57,28.37 20.14,28.4 21.57,29.82 v23.75,29.82
LCD-D7  (via drill 0.3)
  Top 0.254: v24.05,25.83 24.19,25.96 U$6.68
  Bottom 0.254: J1.LCD-D7 10.12,21.14 15.95,26.98 22.91,26.98 v24.05,25.83
LCD-D10  (via drill 0.3)
  Top 0.254: v26.16,28.78 26.19,28.75 U$6.64
  Bottom 0.254: J1.LCD-D10 2.54,22.43 10.82,22.43 15.8,27.41 24.79,27.41 v26.16,28.78
LCD-D11  (via drill 0.3)
  Top 0.254: U$6.63 26.69,25.09 25.86,24.26 v25.86,23.62
  Bottom 0.254: J1.LCD-D11 10.24,18.6 15.39,23.75 15.52,23.62 v25.86,23.62
LCD-D12  (via drill 0.3)
  Top 0.254: U$6.62 27.19,24.67 v26.8,24.28
  Bottom 0.254: J1.LCD-D12 2.56,19.91 9.58,19.91 13.95,24.28 v26.8,24.28
LCD-D13  (via drill 0.3)
  Top 0.254: v27.71,22.53 27.71,27.02 U$6.61
  Bottom 0.254: J1.LCD-D13 10.04,16.06 16.18,22.2 27.38,22.2 v27.71,22.53
LCD-D14  (via drill 0.3)
  Top 0.254: v32.46,24.05 v32.45,24.05 U$6.58
  Bottom 0.254: J1.LCD-D14 2.46,17.27 9.5,17.27 15.24,23.01 26.09,23.01 26.64,23.57 27.03,23.57 27.51,24.05 v32.46,24.05
LCD-D15  (via drill 0.3)
  Top 0.254: U$6.57 31.85,23.55 v32.38,23.01
  Bottom 0.254: J1.LCD-D15 8.72,13.52 16.33,21.13 31.65,21.13 32.66,22.15 32.66,22.73 v32.38,23.01
LCD-D18  (via drill 0.3)
  Top 0.254: U$6.54 29.71,22.07 31.47,22.07 v31.67,22.28
  Bottom 0.254: J1.LCD-D18 2.48,14.76 9.32,14.76 16.26,21.69 31.09,21.69 v31.67,22.28
LCD-D19  (via drill 0.3)
  Top 0.254: U$6.53 32.86,21.55 v32.97,21.44
  Bottom 0.254: J1.LCD-D19 8.43,10.98 8.7,10.98 9.18,10.98 18.29,20.09 32.74,20.09 33.17,20.52 33.17,21.23 v32.97,21.44
LCD-D20  (via drill 0.3)
  Top 0.254: U$6.52 32.09,21.05 v32.33,20.8
  Bottom 0.254: J1.LCD-D20 2.46,12.19 8.38,12.19 8.66,12.47 9.86,12.47 17.98,20.6 32.13,20.6 v32.33,20.8
LCD-D21  (via drill 0.3)
  Top 0.254: v26.42,18.82 26.42,20.04 26.92,20.55 U$6.51
  Bottom 0.254: J1.LCD-D21 8.52,8.44 19.1,19.02 26.21,19.02 v26.42,18.82
LCD-D22  (via drill 0.3)
  Top 0.254: U$6.50 28,20.05 v27.43,19.48
  Bottom 0.254: J1.LCD-D22 2.51,9.7 8.59,9.7 18.41,19.53 27.38,19.53 v27.43,19.48
LCD-D23  (via drill 0.3)
  Top 0.254: v28.12,18.77 28.12,19.02 28.64,19.55 U$6.49
  Bottom 0.254: J1.LCD-D23 7.91,5.9 19.81,17.8 27.15,17.8 v28.12,18.77
LCD-DE  (via drill 0.3)
  Top 0.254: v2.49,4.42 2.49,26.92 3.07,27.51 14.45,27.51 v16,25.96 | v18.19,25.12 U$6.80
  Bottom 0.254: J1.LCD-DE 2.49,2.12 v2.49,4.42 | v16,25.96 17.35,25.96 v18.19,25.12
LCD-HSYNC
  Top 0.254: U$6.1 6.3,25.05 5.28,24.03 5.28,4.86 J1.LCD-HSYNC
LCD-VSYNC
  Top 0.254: U$6.2 6.66,24.55 5.82,23.7 5.82,3.15 4.78,2.11 2.5,2.11 J1.LCD-VSYNC
LCD_CLK  (via drill 0.3)
  Top 0.254: U$6.66 25.19,18.58 v25.02,18.41
  Bottom 0.254: J1.LCD-CLK 2.44,7.09 8.41,7.09 19.56,18.24 24.84,18.24 arc90 v25.02,18.41
N$1
  Bottom 0.254: 5.94,44.86 5.94,43.61 5.92,43.59
N$5
  Bottom 0.254: J1.LCD-D2 2.54,30.05 6.83,30.05 7.77,30.99 7.77,35.25 R19.1 7.98,35.61 6.71,35.61 6.22,36.09 6.22,38.81 6.49,39.08 U1.2
N$11
  Top 0.254: U$6.26 20.69,11.87 20.51,11.7 J3.12
N$12
  Bottom 0.406: JP1.2 5.21,43.43 4.52,42.75 2.79,42.75 2.49,43.05 2.49,47.78 J1.CHG-IN
N$14
  Top 0.254: U$6.27 21.19,11.83 21.51,11.51 J3.10
N$15
  Top 0.254: U$6.36 25.69,11.65 26.01,11.32 J3.1
N$16
  Top 0.254: U$6.35 25.19,11.6 25.01,11.43 J3.3
N$17
  Top 0.254: U$6.33 24.19,11.63 24.51,11.3 J3.4
N$18
  Top 0.254: U$6.32 23.69,11.67 23.51,11.5 J3.6
N$19
  Top 0.254: U$6.30 22.69,11.78 23.01,11.45 J3.7
N$20
  Top 0.254: U$6.29 22.19,11.75 22.02,11.58 22.02,9.43 J3.9
N$22  (via drill 0.3)
  Top 0.254: J3.19 17.01,7.67 16.64,7.29 v16.18,7.29 | v19.79,16.56 19.77,16.55 U$6.18
  Bottom 0.254: v16.18,7.29 17.65,8.76 17.65,10.26 18.49,11.1 18.49,15.44 19.61,16.56 v19.79,16.56
N$24  (via drill 0.3)
  Top 0.254: C18.1 C19.1 L3.1 | 10.29,10.68 C18.1 | U$6.23 19.19,12.61 18.87,12.29 17.42,12.29 v17.2,12.52 | v15.88,10.26 15.54,10.59 10.53,10.59 arc90 C18.1
  Bottom 0.254: v17.2,12.52 15.88,11.2 v15.88,10.26
N$25
  Top 0.254: U$6.19 13.93,16.05 12.72,17.25 12.72,17.7 12.55,17.88 10.68,17.88 R8.1 9.68,16.98 9.68,15.04 10.16,14.55 12.19,14.55 13.26,13.49 13.26,11.56 13.66,11.15 18.24,11.15 18.51,10.87 J3.16
N$27
  Top 0.254: 10.96,16.23 R9.1 10.98,15.54 14.5,15.54 | U$6.20 14.5,15.54 | J3.15 19.01,11.21 18.57,11.66 14.25,11.66 13.84,12.06 13.84,14.88 14.5,15.54
N$28  (via drill 0.3)
  Top 0.254: U$6.21 18.19,14.81 18.8,15.42 v19.53,15.42
  Bottom 0.254: R6.2 19.53,14.87 v19.53,15.42
N$29  (via drill 0.3)
  Top 0.254: U$6.24 19.69,12.12 v19.46,11.89
  Bottom 0.254: R7.1 19.66,9.61 19.66,11.68 v19.46,11.89
N$32  (via drill 0.3)
  Top 0.254: U$6.5 17.08,23.05 17.45,23.42 17.45,28.52 | v19.91,30.63 19.81,30.53 17.7,30.53 17.45,30.28 17.45,28.52 | TP1.TP 17.42,28.5 17.45,28.52
  Bottom 0.254: v19.91,30.63 19.86,30.68 U$5.5
N$33
  Bottom 0.254: L4.1 24.63,3.71 22.86,3.71 D1.1
N$35  (via drill 0.3)
  Top 0.254: v17.5,6.35 17.5,9.41 J3.18
  Bottom 0.254: D1.3 22.66,2.66 C26.1 C25.1 16.8,2.66 16.23,3.23 16.23,5.08 v17.5,6.35
N$57  (via drill 0.3)
  Top 0.254: v28.27,31.09 27.64,31.09 Q2.2
  Bottom 0.254: U$5.1 22.46,31.21 22.61,31.06 25.09,31.06 | 25.09,31.06 25.83,31.06 Q2.2 27.38,31.98 | 27.38,31.98 27.7,31.98 C44.1 | 27.38,31.98 v28.27,31.09 | R22.2 25.15,31.11 25.09,31.06
N$58  (via drill 0.3)
  Top 0.254: Q2.1 v28.14,41.63
  Bottom 0.254: U$5.28 22.46,40.27 22.78,40.59 24.84,40.59 | 24.84,40.59 27.8,40.59 C43.1 28.14,40.6 v28.14,41.63 | R22.1 25.15,40.28 24.84,40.59
N$61  (via drill 0.3)
  Top 0.254: R23.2 19.43,39.27 18.57,38.41 18.57,37.26 17.53,36.22 v17.14,36.22
  Bottom 0.254: v17.14,36.22 17.26,36.1 U$5.9
N$62
  Top 0.254: AUDIO_USB.D+ 20.19,43.09 R23.1 R25.1
N$63  (via drill 0.3)
  Top 0.254: R24.2 21.82,39.24 21.01,38.43 19.38,38.43 19.07,38.12 19.07,36.5 v18.44,35.87
  Bottom 0.254: U$5.8 17.91,35.34 v18.44,35.87
N$64
  Top 0.254: AUDIO_USB.D- 20.84,43.3 R24.1
N$65  (via drill 0.3)
  Top 1.27: v32.03,31.47 32.03,33.12 D6.A
  Bottom 1.27: VIN.1 27.57,45.78 28.98,44.37 32.89,44.37 34.19,43.08 34.19,39.34 31.95,37.11 31.95,31.55 v32.03,31.47
N$66  (via drill 0.3)
  Top 0.254: v15.82,35.51 C45.2 15.83,39.76 16.1,40.03 v16.1,43.87 | v21.64,43.89 21.49,44.04 AUDIO_USB.VBUS
  Bottom 0.254: U$5.10 16.61,34.72 v15.82,35.51 | v16.1,43.87 21.61,43.87 v21.64,43.89
N$69  (via drill 0.3)
  Top 0.254: R26.2 21.87,36.67 v21.87,35.81
  Bottom 0.254: v21.87,35.81 21.16,35.11 U$5.3
RST  (via drill 0.3)
  Top 0.254: U$6.42 31.86,16.05 32.18,15.72 32.18,13.35 C24.1 32.15,11.12 R5.1 v32.13,9.63
  Bottom 0.254: 32.33,9.42 v32.13,9.63 32.54,9.22 35.05,9.22 35.59,9.75 35.59,32.62 J1.XIO-P0
TWI1_SCK  (via drill 0.3)
  Top 0.254: U$6.43 32.55,16.55 v33.15,15.95 | J1.TWI1-SCK 2.53,35.1 4.45,35.1 4.8,35.46 9.65,35.46 10.34,34.77 22.12,34.77 23.16,35.81 33.98,35.81 v35.03,34.77
  Bottom 0.254: v33.15,15.95 34.85,15.95 35.05,16.15 35.05,34.75 v35.03,34.77
TWI1_SDA  (via drill 0.3)
  Top 0.254: U$6.44 33.5,17.05 v33.91,16.64 | v33.86,34.67 33.33,35.2 23.29,35.2 22.45,34.37 9.8,34.37 9.4,34.77 5.71,34.77 v5.69,34.8
  Bottom 0.254: v33.91,16.64 33.68,16.87 33.68,18.29 34.57,19.18 34.57,33.96 v33.86,34.67 | J1.TWI1-SDA 2.5,37.67 5,37.67 5.21,37.47 5.21,35.28 v5.69,34.8
USBV  (via drill 0.3)
  Top 0.406: v8.99,43.36 11.07,43.36 11.54,43.82 POWER_USB.VBUS
  Bottom 0.406: JP1.1 6.76,44.96 8.36,43.36 v8.99,43.36
VCC  (via drill 0.3)
  Top 0.254: C23.1 U$6.48 C23.1 32.23,18.97 32.23,18.06 v32.59,17.7 | v21.69,15.19 21.69,14.88 U$6.28 | v24.69,15.16 U$6.34 | R5.2 34.02,10.09 v33.88,9.96 | U$6.13 12.79,19.05 C22.1 11.79,20.05 v11.79,21.21 | C21.1 22.69,29.22 U$6.71 22.69,29.41 22.48,29.62 22.48,29.49 v21.67,28.68 | C28.1 6.39,31.75 U2.1 6.39,29.71 v6.07,29.39 | U2.3 8.5,33.68 v9.4,33.68 | R8.2 8.68,17.88 v6.53,17.88 | L3.2 C20.1 8.55,3.08 8.89,2.74 v9.02,2.74 | R9.2 6.93,15.9 v6.48,15.44
  Bottom 0.254: C30.1 25.65,14.68 25.17,15.16 v24.69,15.16 | C29.1 23.09,13.97 21.87,15.19 v21.69,15.19 | R19.2 9.95,34.24 v9.4,33.68 | R7.2 19.53,7.43 v19.53,6.33
  pour Route15 (isolate 0.254): 40.6,0.4 40.6,49.6 0.4,49.6 0.4,0.4
VCC2  (via drill 0.3)
  Top 0.254: R26.1 19.84,36.53 v19.84,36.02 | C46.1 19.43,32.68 v19.43,33.73 | R25.2 17.25,37.74 v17.55,37.44
  Bottom 0.254: U$5.7 18.56,33.78 | 18.56,33.78 18.56,33.98 20.21,35.62 | 20.21,35.62 20.51,35.93 | 20.51,35.93 20.51,36.85 | 20.51,36.85 20.51,37.87 | 20.51,37.87 U$5.25 | U$5.26 21.16,37.5 20.51,36.85 | v19.84,36.02 20.21,35.65 20.21,35.62 | U$5.4 20.51,35.93 | v19.43,33.73 19.38,33.78 18.56,33.78 | v17.55,37.44 17.91,37.8 U$5.21 17.91,37.89 17.96,37.85 20.49,37.85 20.51,37.87
  pour Bottom (isolate 0.254): 17.91,37.95 20.85,37.95 21.23,37.57 21.23,36.45 20.52,35.74 20.52,33.76 20.35,33.58 18.75,33.58 18.54,33.78 18.54,34.95 19.18,35.59 19.18,36.2 18.82,36.55 18.01,36.55 17.68,36.88 17.68,37.72
VIN
  Top 1.27: D6.C 31.97,42.02 U$9.VIN
VOUT
  Bottom 0.813: JP1.3 12.22,41.91 U$9.VOUT

### Text on the board
Unrouted: not ordered
tNames: JKW / v3